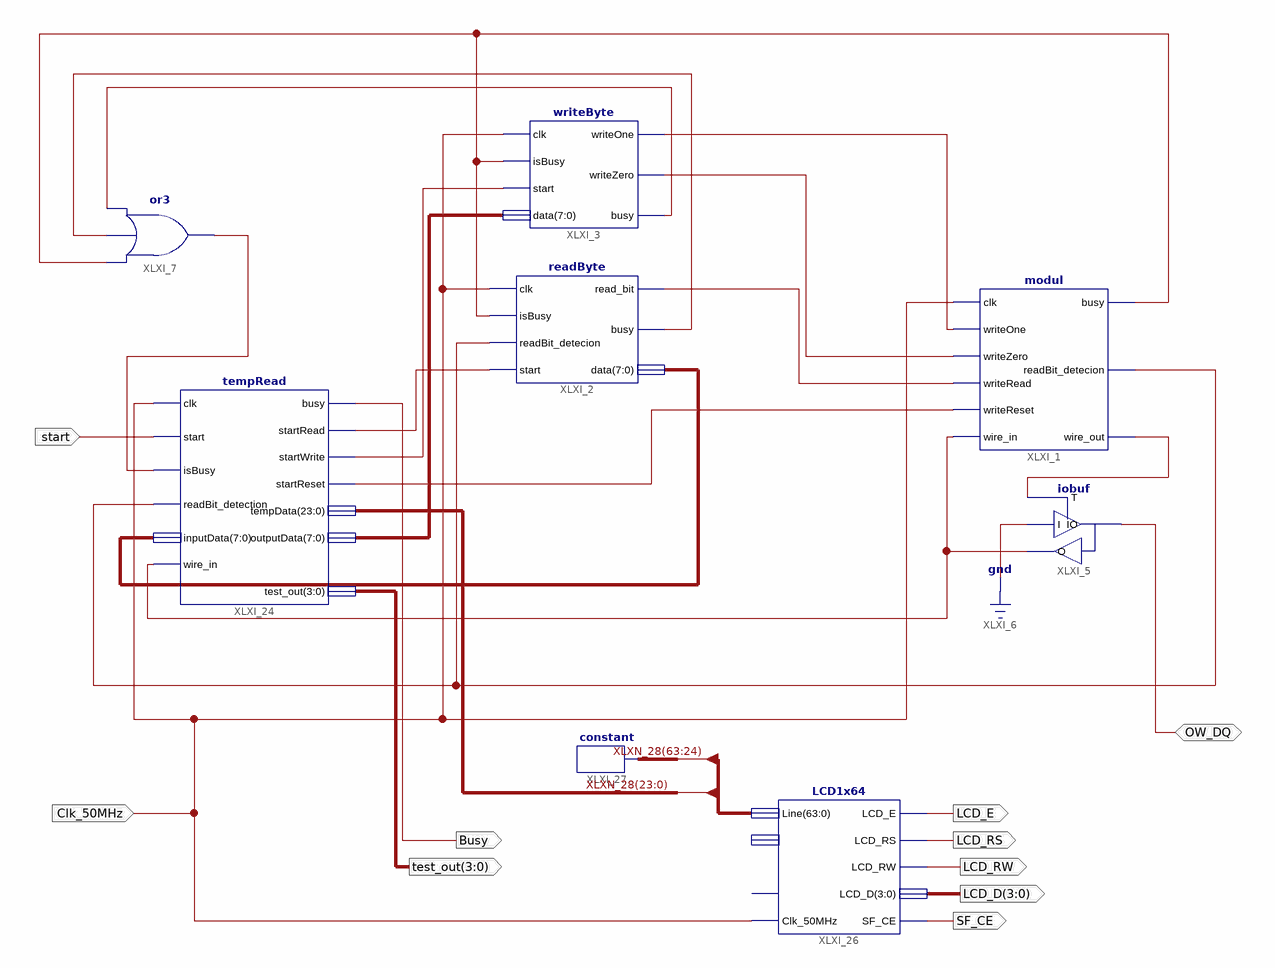
[diagram p0: schematic sheet 1]
// Xilinx ISE schematic sequenceTestSchema.sch (spartan3e) as structural Verilog: 8 symbols, 10 ports
module sequenceTestSchema (
  input  start,
  input  Clk_50MHz,
  inout  OW_DQ,
  output Busy,
  output LCD_E,
  output LCD_RS,
  output LCD_RW,
  output [3:0] LCD_D,
  output SF_CE,
  output [3:0] test_out
);

  wire B, C, D, XLXN_1, XLXN_3, XLXN_4, XLXN_8, XLXN_10, XLXN_11, XLXN_15, XLXN_16, XLXN_26, XLXN_27;
  wire [7:0] XLXN_9, XLXN_12;
  wire [63:0] XLXN_28;

  modul XLXI_1 (
    .clk(Clk_50MHz), .writeOne(XLXN_1), .writeZero(XLXN_3), .writeRead(XLXN_4), .writeReset(XLXN_8),
    .wire_in(XLXN_27), .busy(D), .readBit_detecion(XLXN_15), .wire_out(XLXN_16));
  readByte XLXI_2 (
    .clk(Clk_50MHz), .isBusy(D), .readBit_detecion(XLXN_15), .start(XLXN_11), .read_bit(XLXN_4), .busy(B),
    .data(XLXN_12));
  writeByte XLXI_3 (
    .clk(Clk_50MHz), .isBusy(D), .start(XLXN_10), .data(XLXN_9), .writeOne(XLXN_1), .writeZero(XLXN_3),
    .busy(C));
  iobuf XLXI_5 (.I(1'b0), .IO(OW_DQ), .O(XLXN_27), .T(XLXN_16));
  or XLXI_7 (XLXN_26, D, B, C);
  tempRead XLXI_24 (
    .clk(Clk_50MHz), .start(start), .isBusy(XLXN_26), .readBit_detection(XLXN_15), .wire_in(XLXN_27),
    .inputData(XLXN_12), .busy(Busy), .startRead(XLXN_11), .startWrite(XLXN_10), .startReset(XLXN_8),
    .tempData(XLXN_28[23:0]), .outputData(XLXN_9), .test_out(test_out));
  LCD1x64 XLXI_26 (
    .Clk_50MHz(Clk_50MHz), .Line(XLXN_28), .LCD_D(LCD_D), .LCD_E(LCD_E), .LCD_RW(LCD_RW), .LCD_RS(LCD_RS),
    .SF_CE(SF_CE));  // open: Reset, Blank
  constant XLXI_27 (.O(XLXN_28[63:24]));
endmodule
